# EAGLE design Tail Lights (EAGLE 9.6.2)
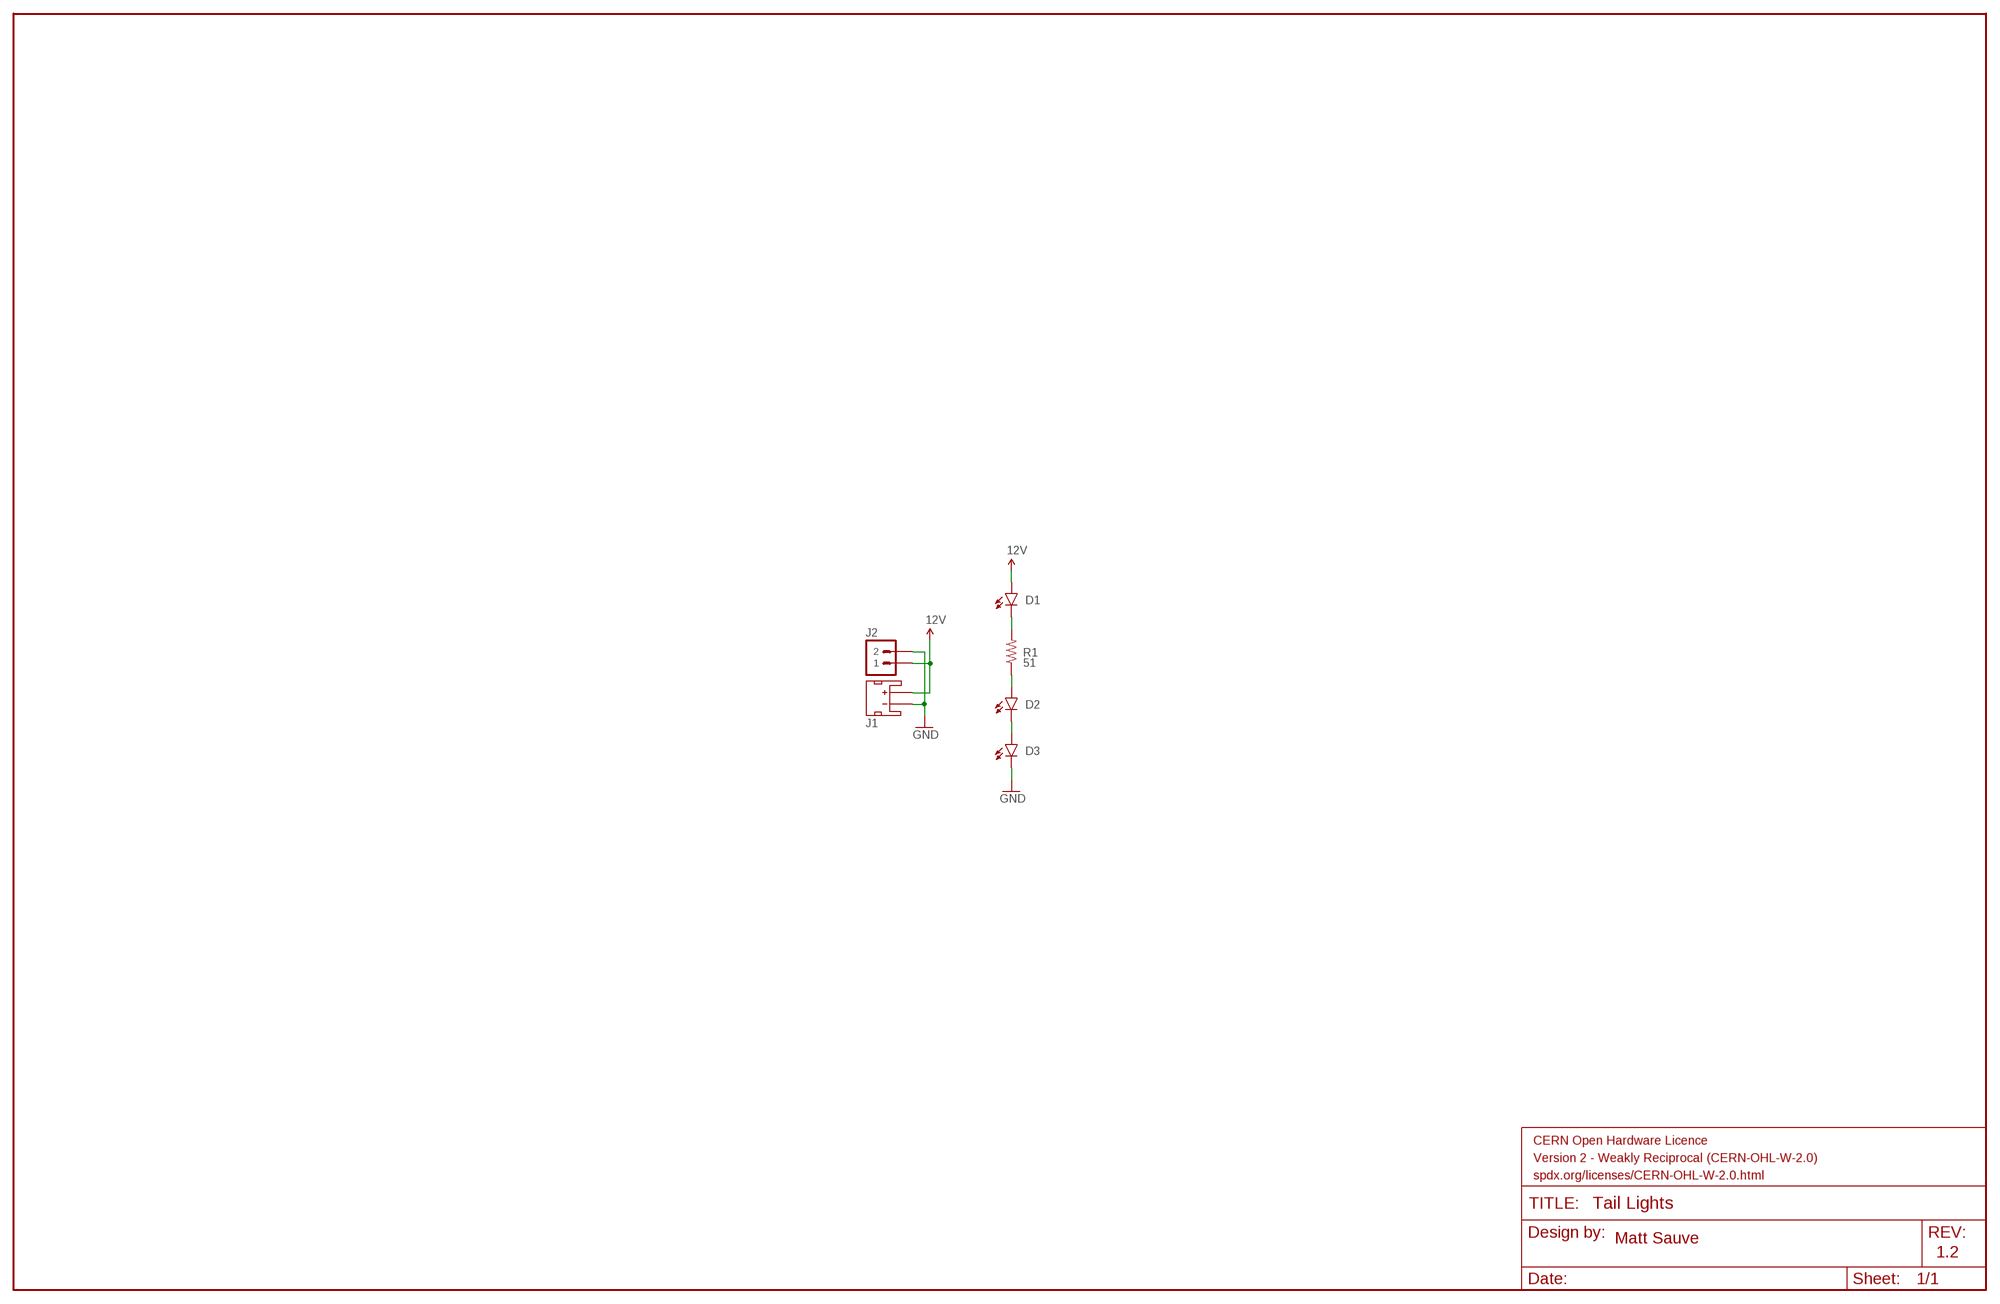
[diagram p0: schematic, sheet 1]

## Parts
D1  RED_CREE_LED  [4-SMD]
D2  RED_CREE_LED  [4-SMD]
D3  RED_CREE_LED  [4-SMD]
FRAME1  FRAME-LEDGER_CERN_WEAK  [CERN_WEAK]
J1  JST_2MM_MALE  [JST-2-SMD]
J2  JST_PH_2POS  [JST_PH_2POS]
R1  51  RESISTOR2512  [R2512]

## Nets
12V: D1.P$1(A) D1.P$2(A) J1.2(+) J2.1
GND: D3.P$3(C) D3.P$4(C) J1.1(-) J2.2
N$1: D2.P$1(A) D2.P$2(A) R1.1
N$2: D1.P$3(C) D1.P$4(C) R1.2
N$14: D2.P$3(C) D2.P$4(C) D3.P$1(A) D3.P$2(A)
Unconnected: J1.NC1(PAD1) J1.NC2(PAD2)

## Notes on the sheet
- Matt Sauve
- 1.2

## Library data of the parts
D1-D3 = SAUVE:RED_CREE_LED; MFPN: VLMR51Z1AA-GS08
FRAME1 = SAUVE:FRAME-LEDGER_CERN_WEAK: Schematic Frame - Ledger Standard 11x14 US Ledger frame
J1 = SparkFun-Connectors:JST_2MM_MALE: JST 2MM MALE RA CONNECTOR Two pin, compact surface mount connector. Commonly used as a battery input connection point. We really like the solid locking feeling and high current rating on these small connectors. We use these all the time as battery connectors. Mates to single-cell LiPo batteries. Here is the connector we sell at SparkFun: JST Right Angle Connector - White <https://www.sparkfun.com/products/8612> (PRT-08612) Datasheet <http://www.sparkfun.com/datasheets/Prototyping/Connectors/JST-Horizontal.pdf> It was used on these SparkFun products: SparkFun MOSFET Power Controller <https://www.sparkfun.com/products/11214> (PRT-11214) SparkFun Battery Babysitter - LiPo Battery Manager <https://www.sparkfun.com/products/13777> (PRT-13777) And many, many others that required a lipo battery connection.; PROD_ID: CONN-11443; SF_ID: PRT-08612
J2 = SAUVE:JST_PH_2POS
R1 = SparkFun-Resistors:RESISTOR: Resistor Basic schematic elements and footprints for 0603, 1206, and PTH resistors.

## Board
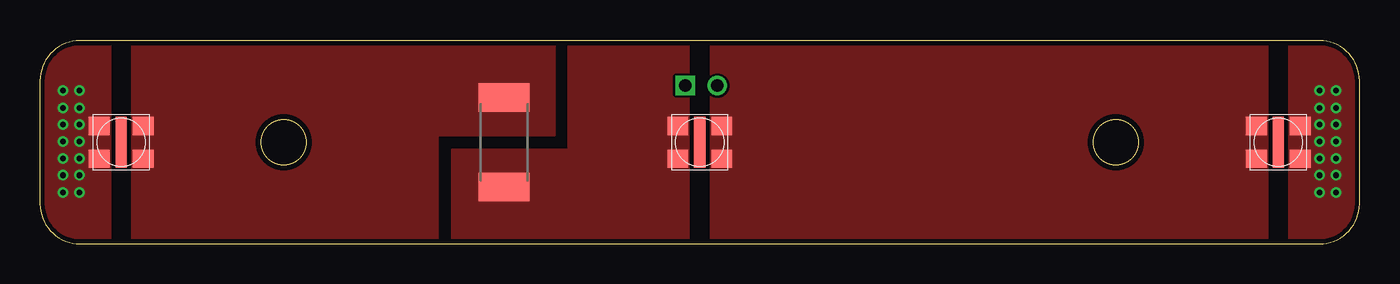
[diagram p1: board, top side]
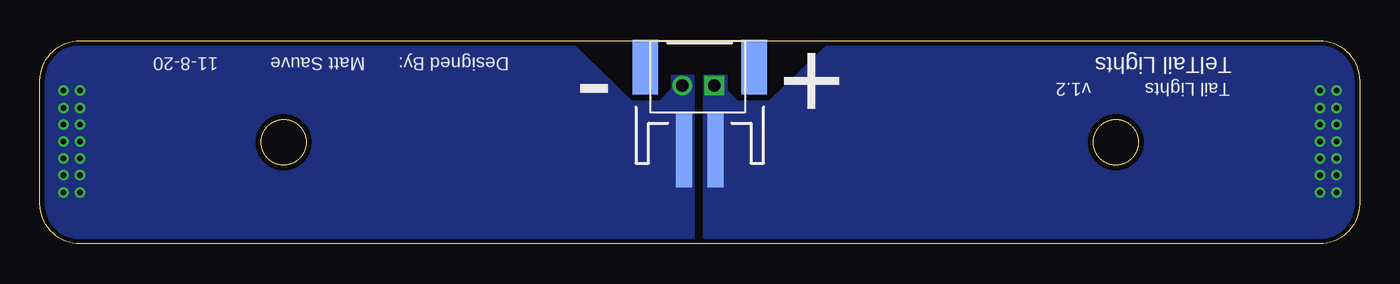
[diagram p2: board, bottom side, seen from below]

Size 82.55 x 12.7 mm. Coordinates in mm from the lower left corner, seen from the top.
Outline: 80.05,12.7 2.5,12.7 arc90 0,10.2 0,2.5 arc90 2.5,0 80.05,0 arc90 82.55,2.5 82.55,10.2 arc90 80.05,12.7
Outline: circle at 15.24,6.35 radius 1.4
Outline: circle at 67.31,6.35 radius 1.4
Copper layers (1*16): Top 0.035mm / dielectric 1.5mm / Bottom 0.035mm
Design rules "ALLPCB": minimum track width 6mil, minimum drill 12mil, track to track 6mil, track to pad 6mil, pad to pad 6mil, via to via 6mil, smd to smd 6mil, copper to edge 12mil, drill to drill 12mil, minimum pad ring 7mil, minimum via ring 6mil, stop-mask expansion 0mil, vias tented up to drill 0.35mm, thermal gap 10mil

### Footprints (pad centres in the part's own frame; a part is rotated, then mirrored left to right if it is on the bottom)
4-SMD = smd 1.3 x 1.15: P$1 -1.38,1.025; P$2 -1.38,-1.025; P$3 1.38,1.025; P$4 1.38,-1.025 | smd 0.7 x 3.2: P$5 0,0
JST-2-SMD = smd 1 x 4.6: 1 -1,-3.7; 2 1,-3.7 | smd 1.6 x 3.4: NC1 -3.4,1.5; NC2 3.4,1.5
JST_PH_2POS = drill 0.8 square: 1 -1.028,0 | drill 0.8: 2 0.972,0
R2512 = smd 1.8 x 3.2: 1 -2.8,0; 2 2.8,0

### Placement (x,y rotation side)
D1  5.08,6.35 0 top
D2  41.27,6.35 0 top
D3  77.47,6.35 0 top
FRAME1  0.5,-7.6 0 top  (outside the outline)
J1  41.27,9.55 0 bottom
J2  41.4,9.9 180 bottom
R1  29.04,6.35 90 top

### Tracks (layer width: path | path; a pad name or v marks a point on that pad's centre or on a via)
12V  (via drill 0.35)
  other vias: 2.48,8.51 2.48,7.45 2.48,6.4 2.48,5.35 2.48,4.29 1.45,4.29 1.45,5.35 1.45,6.4 1.45,7.45 1.45,8.51 2.48,3.2 1.45,3.2 1.45,9.6 2.48,9.6
  pour Top (no thermals): 0,0 0,12.7 4.38,12.7 4.38,0
  pour Bottom (no thermals): 41,7.81 41,0 0,0 0,12.7 33,12.7 36.94,8.9 38.9,8.9 39.6,9.6 39.6,10.5 41,10.5
GND  (via drill 0.35)
  other vias: 81.08,8.51 81.08,7.45 81.08,6.4 81.08,5.35 81.08,4.29 80.05,4.29 80.05,5.35 80.05,6.4 80.05,7.45 80.05,8.51 81.08,3.2 80.05,3.2 80.05,9.6 81.08,9.6
  pour Top (no thermals): 78.17,0 78.17,12.7 82.55,12.7 82.55,0
  pour Bottom (no thermals): 41.67,8.1 41.67,0 82.55,0 82.55,12.7 49.44,12.7 45.5,8.9 43.8,8.9 43,9.7 43,10.5 41.7,10.5 41.67,10.47
N$1
  pour Top (no thermals): 25.78,0 25.78,5.9 33.08,5.9 33.08,12.7 40.58,12.7 40.58,0
N$2
  pour Top (no thermals): 5.78,0 5.78,12.7 32.18,12.7 32.18,6.8 24.88,6.8 24.88,0
N$14
  pour Top (no thermals): 41.98,0 41.98,12.7 76.77,12.7 76.77,0

### Text on the board
bPlace: TelTail Lights | Designed By: | Matt Sauve | 11-8-20 | Tail Lights | v1.2 | + | -